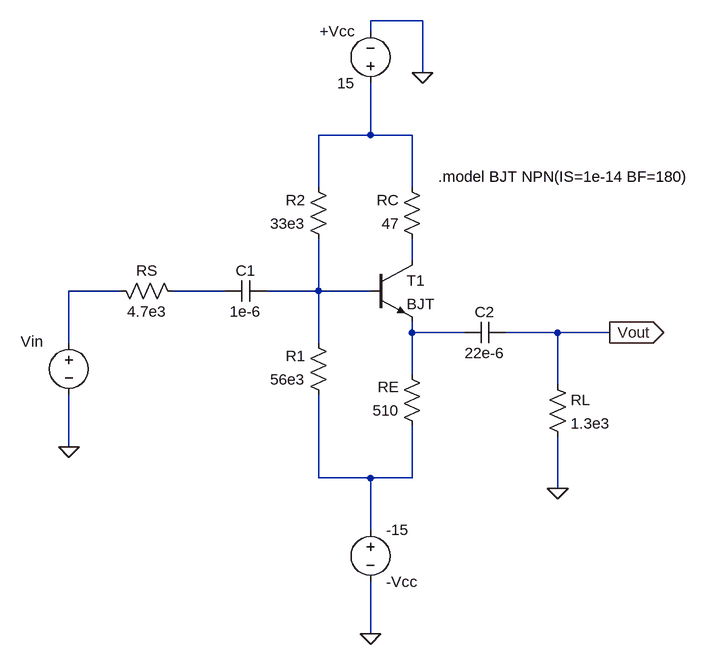
[diagram p0: schematic faz2A.asc]
faz2A.asc, the LTspice schematic file:
Version 4
SHEET 1 956 768
WIRE 64 -304 -16 -304
WIRE -16 -288 -16 -304
WIRE 64 -224 64 -304
WIRE -16 -128 -16 -208
WIRE -16 -128 -96 -128
WIRE 48 -128 -16 -128
WIRE -96 -48 -96 -128
WIRE 48 -48 48 -128
WIRE 48 64 48 32
WIRE -400 112 -480 112
WIRE -240 112 -320 112
WIRE -96 112 -96 32
WIRE -96 112 -176 112
WIRE -16 112 -96 112
WIRE 48 176 48 160
WIRE 128 176 48 176
WIRE 272 176 192 176
WIRE 352 176 272 176
WIRE -480 192 -480 112
WIRE -96 192 -96 112
WIRE 48 240 48 176
WIRE 272 256 272 176
WIRE -480 352 -480 272
WIRE -96 400 -96 272
WIRE -16 400 -96 400
WIRE 48 400 48 320
WIRE 48 400 -16 400
WIRE 272 416 272 336
WIRE -16 480 -16 400
WIRE -16 640 -16 560
FLAG 64 -224 0
FLAG -480 352 0
FLAG -16 640 0
FLAG 272 416 0
FLAG 352 176 Vout
IOPIN 352 176 Out
SYMBOL cap -176 96 R90
WINDOW 0 0 32 VBottom 2
WINDOW 3 32 32 VTop 2
SYMATTR InstName C1
SYMATTR Value 1e-6
SYMBOL res -80 48 R180
WINDOW 0 36 76 Left 2
WINDOW 3 36 40 Left 2
SYMATTR InstName R2
SYMATTR Value 33e3
SYMBOL res -80 288 R180
WINDOW 0 36 76 Left 2
WINDOW 3 36 40 Left 2
SYMATTR InstName R1
SYMATTR Value 56e3
SYMBOL npn -16 64 R0
SYMATTR InstName T1
SYMATTR Value BJT
SYMBOL res 64 48 R180
WINDOW 0 36 76 Left 2
WINDOW 3 36 40 Left 2
SYMATTR InstName RC
SYMATTR Value 47
SYMBOL voltage -16 464 R0
WINDOW 0 24 96 Left 2
WINDOW 3 24 16 Left 2
WINDOW 123 0 0 Left 0
WINDOW 39 0 0 Left 0
SYMATTR InstName -Vcc
SYMATTR Value -15
SYMBOL voltage -16 -192 R180
WINDOW 0 24 96 Left 2
WINDOW 3 24 16 Left 2
WINDOW 123 0 0 Left 0
WINDOW 39 0 0 Left 0
SYMATTR InstName +Vcc
SYMATTR Value 15
SYMBOL voltage -480 176 R0
WINDOW 123 -74 42 Left 2
WINDOW 39 0 0 Left 0
WINDOW 0 -74 14 Left 2
WINDOW 3 -74 42 Left 2
SYMATTR InstName Vin
SYMATTR Value ""
SYMBOL res -416 96 M90
WINDOW 0 0 56 VBottom 2
WINDOW 3 32 56 VTop 2
SYMATTR InstName RS
SYMATTR Value 4.7e3
SYMBOL cap 192 160 R90
WINDOW 0 0 32 VBottom 2
WINDOW 3 32 32 VTop 2
SYMATTR InstName C2
SYMATTR Value 22e-6
SYMBOL res 256 240 R0
SYMATTR InstName RL
SYMATTR Value 1.3e3
SYMBOL res 64 336 R180
WINDOW 0 36 76 Left 2
WINDOW 3 36 40 Left 2
SYMATTR InstName RE
SYMATTR Value 510
TEXT 88 -64 Left 2 !.model BJT NPN(IS=1e-14 BF=180)

The netlist it stands for:
* faz2A.asc
C1 N005 N004 1e-6
R2 N005 N001 33e3
R1 N007 N005 56e3
Q§T1 N002 N005 N006 0 BJT
RC N002 N001 47
V§-Vcc N007 0 -15
V§+Vcc N001 0 15
Vin N003 0
RS N003 N004 4.7e3
C2 Vout N006 22e-6
RL Vout 0 1.3e3
RE N007 N006 510
.model NPN NPN
.model PNP PNP
.lib standard.bjt
.model BJT NPN(IS=1e-14 BF=180)
.backanno
.end